# EasyEDA schematic SCH_NFC-Business-Card_2024-04-13.json
TITLE: PCB Business card; REV: 2.0; Date: 2024-04-13; Sheet: 1/1; Drawn By: Ziv Barcesat; Company: Magrathea Tech Solutions
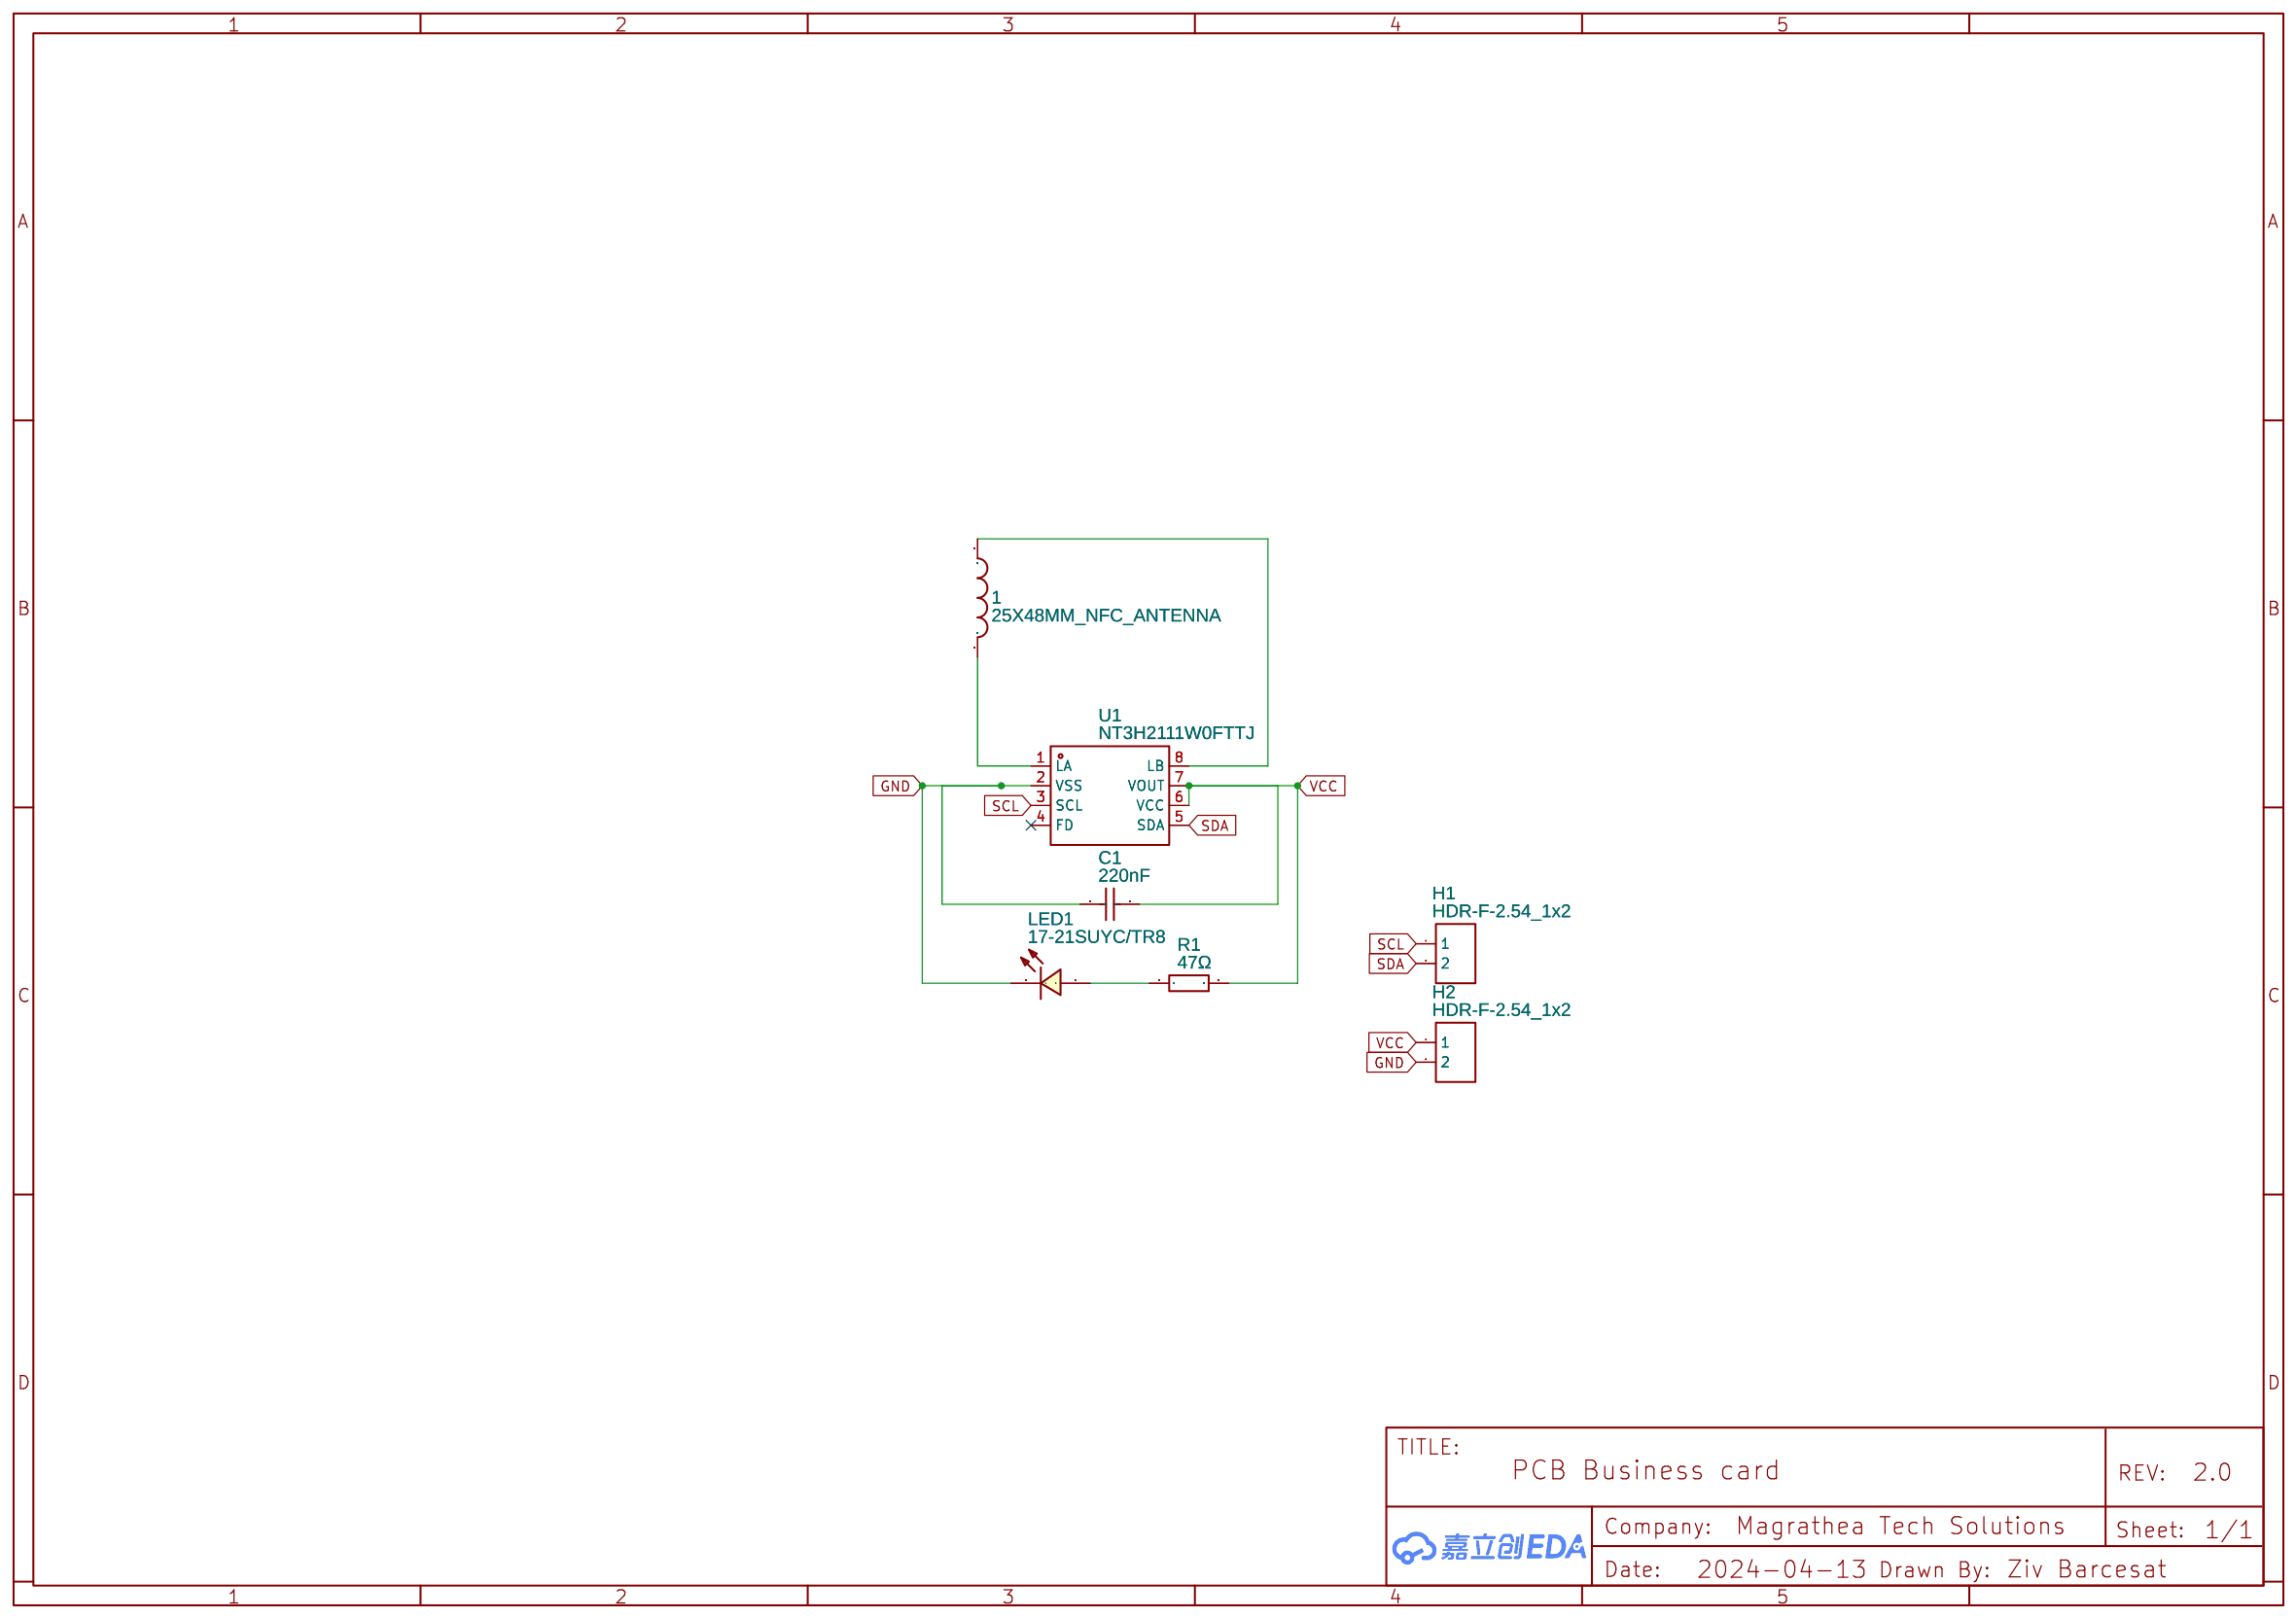
[diagram p0: schematic sheet]

## Parts
1  25X48MM_NFC_ANTENNA  [25X48MM_NFC_ANTENNA]
C1  220nF  [C0603]
H1  HDR-F-2.54_1x2  [HDR-F-2.54_1X2]
H2  HDR-F-2.54_1x2  [HDR-F-2.54_1X2]
LED1  17-21SUYC/TR8  [LED0805-R-RD]
R1  47Ω  [R0603]
U1  NT3H2111W0FTTJ  [TSSOP-8_L4.4-W3.0-P0.65-LS6.4-BR]

## Library data of the parts
1 = 25X48MM_NFC_ANTENNA: Contributor: LoneWalkerWolf
C1 = CL10B224KA8NNNC: Supplier: LCSC; Manufacturer: SAMSUNG(三星); Supplier Part: C21120; JLCPCB Part Class: Basic Part
H1 H2 = HDR-F-2.54_1x2: Supplier Part: C49661; Supplier: LCSC; Contributor: LCEDA_Lib
LED1 = 17-21SUYC/TR8: Supplier: LCSC; Manufacturer: KENTO; Manufacturer Part: KT-0805黄灯; Supplier Part: C2296; JLCPCB Part Class: Basic Part
R1 = 0603WAF470JT5E: Supplier: LCSC; Manufacturer: UNI-ROYAL(厚声); Supplier Part: C23182; Resistance (Ohms): 47; JLCPCB Part Class: Basic Part
U1 = NT3H2111W0FTTJ: Contributor: LCSC; Supplier: LCSC; Supplier Part: C2654884; Manufacturer: NXP(恩智浦); JLCPCB Part Class: Extended Part

## Nets
GND: C1.1 H2.2 LED1.2(-) U1.2(VSS)
VCC: C1.2 H2.1 R1.2 U1.6(VCC) U1.7(VOUT)
SCL: H1.1 U1.3(SCL)
SDA: H1.2 U1.5(SDA)
Net-(1-P$1): 1.P$1 U1.8(LB)
Net-(1-P$2): 1.P$2 U1.1(LA)
Net-(LED1-1): LED1.1(+) R1.1

Not connected (* = marked no-connect by the designer): U1 4(FD)*
